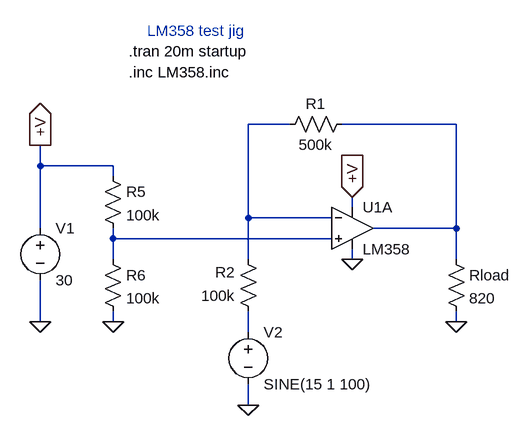
[diagram p0: schematic LM358_test_jig.asc]
LM358_test_jig.asc, the LTspice schematic file:
Version 4
SHEET 1 880 680
WIRE -320 -112 -384 -112
WIRE -64 -112 -240 -112
WIRE -704 -48 -704 -80
WIRE -592 -48 -704 -48
WIRE -592 -32 -592 -48
WIRE -224 16 -224 0
WIRE -384 32 -384 -112
WIRE -256 32 -384 32
WIRE -704 48 -704 -48
WIRE -64 48 -64 -112
WIRE -64 48 -192 48
WIRE -592 64 -592 48
WIRE -256 64 -592 64
WIRE -592 96 -592 64
WIRE -384 96 -384 32
WIRE -224 96 -224 80
WIRE -64 96 -64 48
WIRE -704 192 -704 128
WIRE -592 192 -592 176
WIRE -64 192 -64 176
WIRE -384 208 -384 176
WIRE -384 320 -384 288
FLAG -704 192 0
FLAG -704 -80 +V
IOPIN -704 -80 Out
FLAG -224 0 +V
IOPIN -224 0 In
FLAG -592 192 0
FLAG -224 96 0
FLAG -384 320 0
FLAG -64 192 0
SYMBOL voltage -704 32 R0
WINDOW 123 0 0 Left 2
WINDOW 39 0 0 Left 2
SYMATTR InstName V1
SYMATTR Value 30
SYMBOL res -368 192 R180
WINDOW 0 36 76 Left 2
WINDOW 3 36 40 Left 2
SYMATTR InstName R2
SYMATTR Value 100k
SYMBOL res -224 -128 R90
WINDOW 0 0 56 VBottom 2
WINDOW 3 32 56 VTop 2
SYMATTR InstName R1
SYMATTR Value 500k
SYMBOL res -80 80 R0
SYMATTR InstName Rload
SYMATTR Value 820
SYMBOL res -608 -48 R0
SYMATTR InstName R5
SYMATTR Value 100k
SYMBOL res -608 80 R0
SYMATTR InstName R6
SYMATTR Value 100k
SYMBOL Opamps\\opamp2 -224 -16 R0
SYMATTR InstName U1A
SYMATTR Value LM358
SYMATTR SpiceModel LM358
SYMBOL voltage -384 192 R0
WINDOW 123 0 0 Left 2
WINDOW 39 0 0 Left 2
SYMATTR InstName V2
SYMATTR Value SINE(15 1 100)
TEXT -568 -224 Left 2 !.tran 20m startup
TEXT -464 -240 Bottom 2 ;LM358 test jig
TEXT -568 -192 Left 2 !.inc LM358.inc

The netlist it stands for:
* LM358_test_jig.asc
V1 +V 0 30
R2 N004 N001 100k
R1 N002 N001 500k
Rload N002 0 820
R5 +V N003 100k
R6 N003 0 100k
XU1A N003 N001 +V 0 N002 LM358 LM358  ; pins In+ In- V+ V- OUT
V2 N004 0 SINE(15 1 100)
.tran 20m startup
* LM358 test jig
.inc LM358.inc
.backanno
.end